# Altium schematic sheet Battery Charger Li-Po 1 Cell 6Vin MCP73831.SchDoc
size 209 x 297 mm; Author: Мурашкин Д.В.; Address1: Address1; Address2: Address2; Address3: Address3; Address4: Address4; DocumentNumber: SS19946-01; Scale: 1:1; Letter1Column: Э; PartName: Контроллер батареи
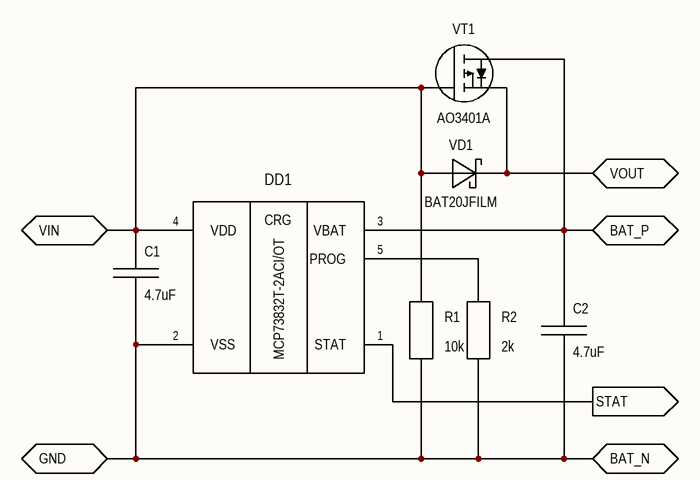
[diagram p0: Battery Charger Li-Po 1 Cell 6Vin MCP73831.SchDoc]

## Parts
C1  4.7uF  [CAPC1608L]
C2  4.7uF  [CAPC1608L]
DD1  MCP73832T-2ACI/OT  [SOT-23-5]
R1  10k  [RESC1608L]
R2  2k  [RESC1608L]
VD1  BAT20JFILM  [SOD-323L]
VT1  AO3401A  [SOT-23]

## Ports
BAT_N, BAT_P, GND, STAT (out), VIN, VOUT

## Nets
BAT_N: C1.2 C2.2 DD1.2(VSS) R1.2 R2.2 ; port GND, port BAT_N
BAT_P: C2.1 DD1.3(VBAT) VT1.3(Drain) ; port BAT_P
STAT: DD1.1(STAT) ; port STAT
VIN: C1.1 DD1.4(VDD) R1.1 VD1.1(Anode) VT1.1(Gate) ; port VIN
VOUT: VD1.2(Cathode) VT1.2(Source) ; port VOUT
NetDD1_5: DD1.5(PROG) R2.1

## Notes on the sheet
- Перв. примен.
- Справ. №
- Подп. и дата
- Инв. № дубл.
- Взам. инв. №
- Разраб.
- Изм.
- Лист
- № докум.
- Подп.
- Дата
- Лит.
- Масса
- Масштаб
- Пров.
- Т.контр.
- Листов
- Инв. № подл.
- Утв.
- Н.контр.
- 2.106-A4
- Копировал
- Формат А4
- (in symbol MCP73832T-2ACI/OT) CRG

## Library data of the parts
C1 C2 = Capacitor Ceramic 4.7uF 6.3V 0603(1608): Group: Ceramic Capacitors; Temperature Coefficient: X7R; Tolerance: ±10%; Type: Ceramic; Voltage: 6.3V; Package: 0603 (1608); Value: 4.7uF
DD1 = MCP73832T-2ACI/OT: Battery Charger Li-ion/Li Polymer; Manufacturer: Microchip Technology; Group: PMIC - Battery Chargers; Package: SOT-23-5; Part name: MCP73832T-2ACI/OT
R1 = Resistor Ceramic 10k 0.1W 0603(1608): Group: Resistors; Temperature Coefficient: ±100ppm/°C; Tolerance: ±5%; Type: Thin Film; Power: 0.1W; Package: 0603 (1608); Value: 10k
R2 = Resistor Ceramic 2k 0.1W 0603(1608): Group: Resistors; Temperature Coefficient: ±100ppm/°C; Tolerance: ±5%; Type: Thin Film; Power: 0.1W; Package: 0603 (1608); Value: 2k
VD1 = BAT20JFILM: Diode Schottky 1A 23V (620mV/1A); Manufacturer: STMicroelectronics; Group: Diodes - Rectifiers - Single; Package: SOD-323; Part name: BAT20JFILM; Current - Average Rectified (Io): 1A; Voltage - Forward (Vf) (Max) @ If: 620mV/1A; Voltage - DC Reverse (Vr) (Max): 23V
VT1 = AO3401A: MOSFET P 4A 30V; Manufacturer: Alpha & Omega Semiconductor; Group: Transistors - FETs, MOSFETs - Single; Part name: AO3401A; Package: SOT-23